# EAGLE design ardcore (EAGLE 6.4)
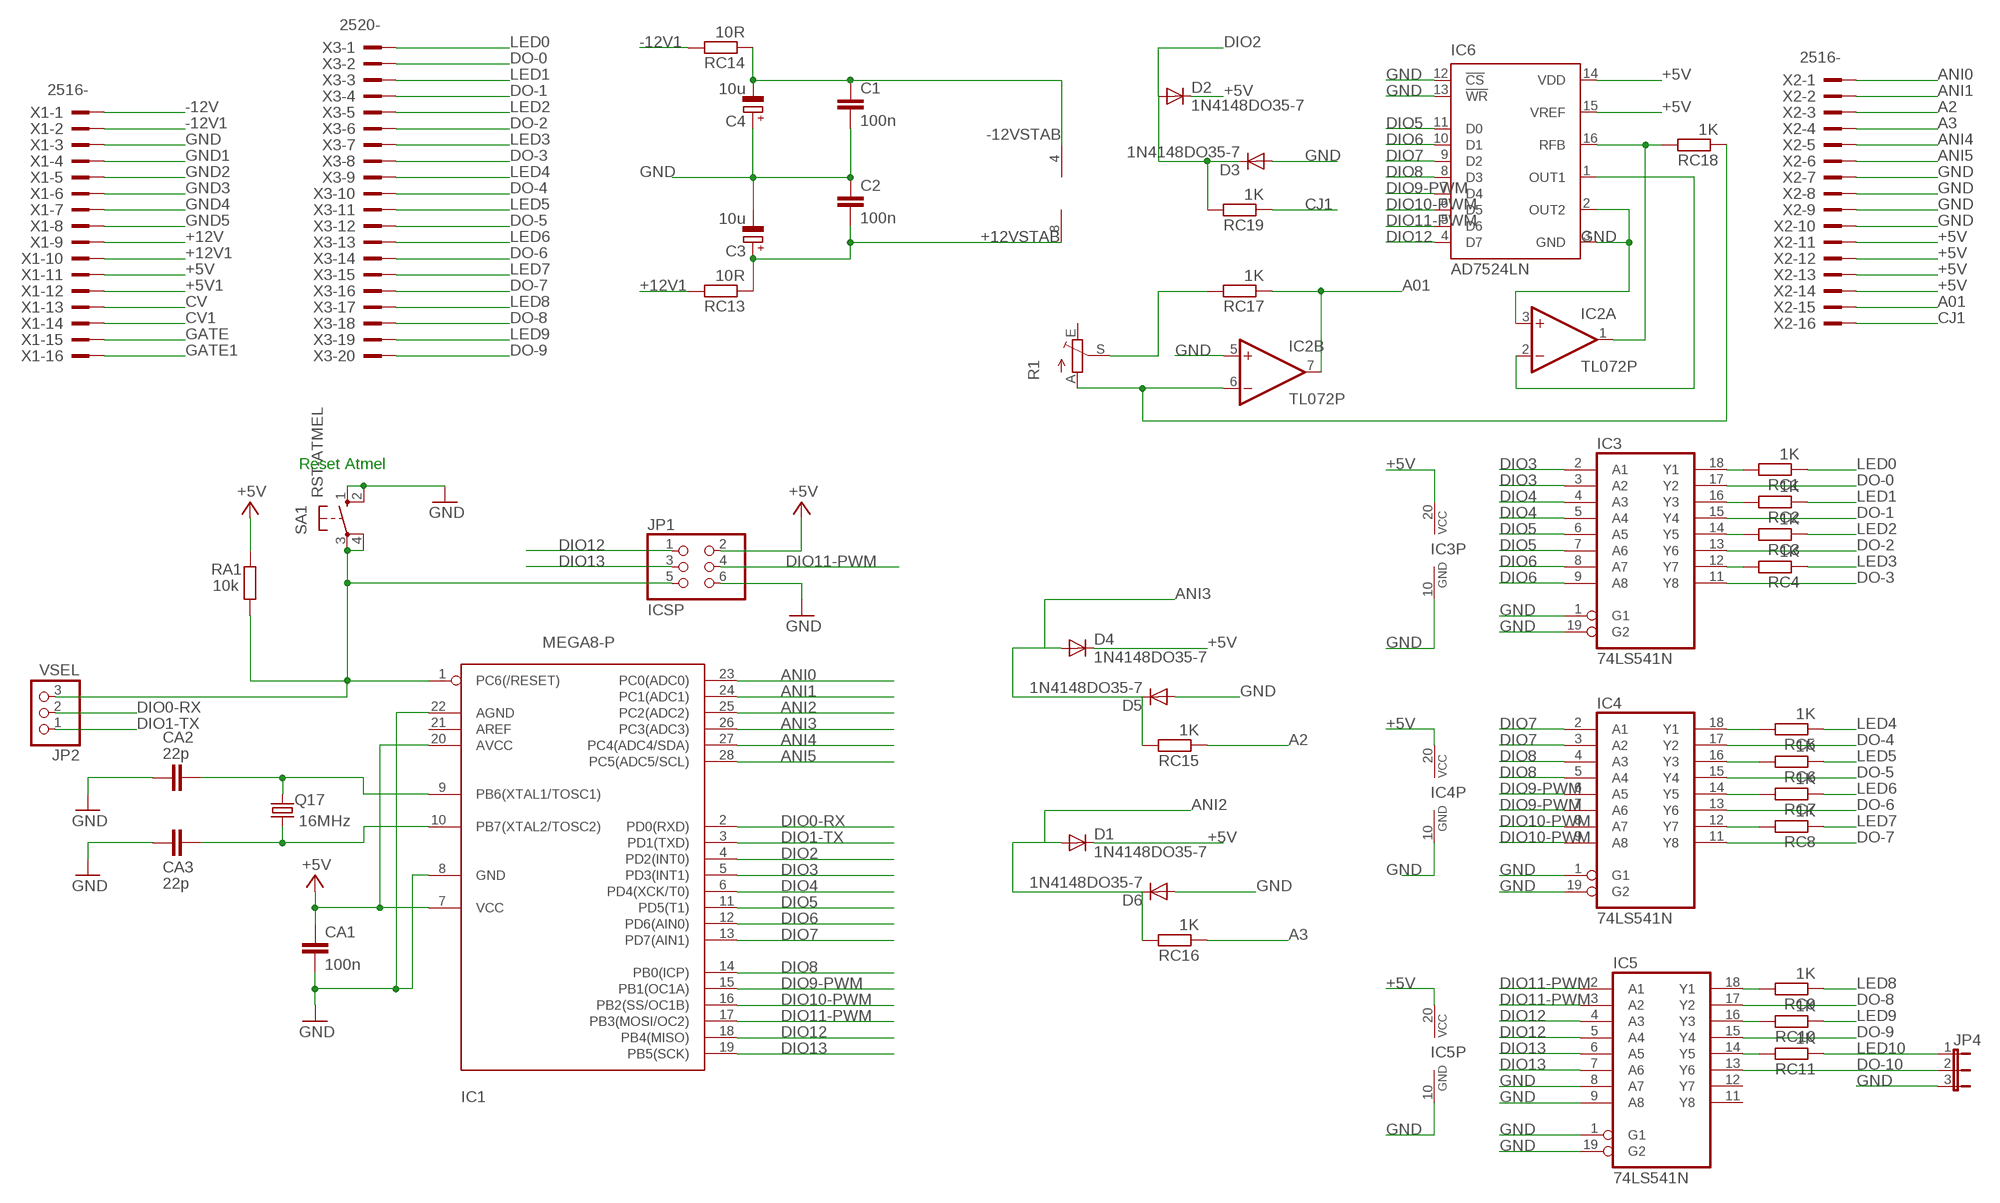
[diagram p0: schematic, sheet 1]

## Parts
C1  100n  C-EU050-025X075  [C050-025X075]
C2  100n  C-EU050-025X075  [C050-025X075]
C3  10u  CPOL-EUE2.5-7  [E2,5-7]
C4  10u  CPOL-EUE2.5-7  [E2,5-7]
CA1  100n  C-EU050-025X075  [C050-025X075]
CA2  22p  C-EU050-025X075  [C050-025X075]
CA3  22p  C-EU050-025X075  [C050-025X075]
D1  1N4148DO35-7  [DO35-7]
D2  1N4148DO35-7  [DO35-7]
D3  1N4148DO35-7  [DO35-7]
D4  1N4148DO35-7  [DO35-7]
D5  1N4148DO35-7  [DO35-7]
D6  1N4148DO35-7  [DO35-7]
IC1  MEGA8-P  [DIL28-3]
IC2  TL072P  [DIL08]
IC3  74LS541N  [DIL20]
IC4  74LS541N  [DIL20]
IC5  74LS541N  [DIL20]
IC6  AD7524LN  [DIL16]
JP1  ICSP  PINHD-2X3  [2X03]
JP2  VSEL  PINHD-1X3  [1X03]
JP4  JP2E  [JP2]
Q17  16MHz  CRYSTALHC49S  [HC49/S]
R1  TRIM_EU-B64Y  [B64Y]
RA1  10k  R-EU_0207/10  [0207/10]
RC1  1K  R-EU_0207/10  [0207/10]
RC2  1K  R-EU_0207/10  [0207/10]
RC3  1K  R-EU_0207/10  [0207/10]
RC4  1K  R-EU_0207/10  [0207/10]
RC5  1K  R-EU_0207/10  [0207/10]
RC6  1K  R-EU_0207/10  [0207/10]
RC7  1K  R-EU_0207/10  [0207/10]
RC8  1K  R-EU_0207/10  [0207/10]
RC9  1K  R-EU_0207/10  [0207/10]
RC10  1K  R-EU_0207/10  [0207/10]
RC11  1K  R-EU_0207/10  [0207/10]
RC13  10R  R-EU_0207/10  [0207/10]
RC14  10R  R-EU_0207/10  [0207/10]
RC15  1K  R-EU_0207/10  [0207/10]
RC16  1K  R-EU_0207/10  [0207/10]
RC17  1K  R-EU_0207/10  [0207/10]
RC18  1K  R-EU_0207/10  [0207/10]
RC19  1K  R-EU_0207/10  [0207/10]
SA1  RST-ATMEL  10-XX  [B3F-10XX]
X1  2516-  [PAK100/2500-16]
X2  2516-  [PAK100/2500-16]
X3  2520-  [PAK100/2500-20]

## Nets
+5V [Power]: CA1.1 D1.C D2.C D4.C IC1.7(VCC) IC1.20(AVCC) IC3.20(VCC) IC4.20(VCC) IC5.20(VCC) IC6.14(VDD) IC6.15(VREF) JP1.2 RA1.1 X1.11 X2.11 X2.12 X2.13 X2.14
+5V1: X1.12
+12V: X1.9
+12V1: RC13.2 X1.10
+12VSTAB: C2.2 C3.+ IC2.8(P:V+) RC13.1
-12V: X1.1
-12V1: RC14.2 X1.2
-12VSTAB: C1.1 C4.- IC2.4(P:V-) RC14.1
A01: IC2.7(B:OUT) RC17.1 X2.15
A2: RC15.1 X2.3
A3: RC16.1 X2.4
ANI0: IC1.23(PC0(ADC0)) X2.1
ANI1: IC1.24(PC1(ADC1)) X2.2
ANI2: D1.A D6.C IC1.25(PC2(ADC2)) RC16.2
ANI3: D4.A D5.C IC1.26(PC3(ADC3)) RC15.2
ANI4: IC1.27(PC4(ADC4/SDA)) X2.5
ANI5: IC1.28(PC5(ADC5/SCL)) X2.6
CJ1: RC19.1 X2.16
CV: X1.13
CV1: X1.14
DIO0-RX: IC1.2(PD0(RXD)) JP2.2
DIO1-TX: IC1.3(PD1(TXD)) JP2.1
DIO2: D2.A D3.C IC1.4(PD2(INT0)) RC19.2
DIO3: IC1.5(PD3(INT1)) IC3.2(A1) IC3.3(A2)
DIO4: IC1.6(PD4(XCK/T0)) IC3.4(A3) IC3.5(A4)
DIO5: IC1.11(PD5(T1)) IC3.6(A5) IC3.7(A6) IC6.11(D0)
DIO6: IC1.12(PD6(AIN0)) IC3.8(A7) IC3.9(A8) IC6.10(D1)
DIO7: IC1.13(PD7(AIN1)) IC4.2(A1) IC4.3(A2) IC6.9(D2)
DIO8: IC1.14(PB0(ICP)) IC4.4(A3) IC4.5(A4) IC6.8(D3)
DIO9-PWM: IC1.15(PB1(OC1A)) IC4.6(A5) IC4.7(A6) IC6.7(D4)
DIO10-PWM: IC1.16(PB2(SS/OC1B)) IC4.8(A7) IC4.9(A8) IC6.6(D5)
DIO11-PWM: IC1.17(PB3(MOSI/OC2)) IC5.2(A1) IC5.3(A2) IC6.5(D6) JP1.4
DIO12: IC1.18(PB4(MISO)) IC5.4(A3) IC5.5(A4) IC6.4(D7) JP1.1
DIO13: IC1.19(PB5(SCK)) IC5.6(A5) IC5.7(A6) JP1.3
DO-0: IC3.17(Y2) X3.2
DO-1: IC3.15(Y4) X3.4
DO-2: IC3.13(Y6) X3.6
DO-3: IC3.11(Y8) X3.8
DO-4: IC4.17(Y2) X3.10
DO-5: IC4.15(Y4) X3.12
DO-6: IC4.13(Y6) X3.14
DO-7: IC4.11(Y8) X3.16
DO-8: IC5.17(Y2) X3.18
DO-9: IC5.15(Y4) X3.20
DO-10: IC5.13(Y6) JP4.2
GATE: X1.15
GATE1: X1.16
GND [GND]: C1.2 C2.1 C3.- C4.+ CA1.2 CA2.2 CA3.2 D3.A D5.A D6.A IC1.8(GND) IC1.22(AGND) IC2.3(A:+IN) IC2.5(B:+IN) IC3.1(G1) IC3.10(GND) IC3.19(G2) IC4.1(G1) IC4.10(GND) IC4.19(G2) IC5.1(G1) IC5.8(A7) IC5.9(A8) IC5.10(GND) IC5.19(G2) IC6.2(OUT2) IC6.3(GND) IC6.12(!CS) IC6.13(!WR) JP1.6 JP4.3 SA1.1(S) SA1.2(S1) X1.3 X2.7 X2.8 X2.9 X2.10
GND1: X1.4
GND2: X1.5
GND3: X1.6
GND4: X1.7
GND5: X1.8
LED0: RC1.1 X3.1
LED1: RC2.1 X3.3
LED2: RC3.1 X3.5
LED3: RC4.1 X3.7
LED4: RC5.1 X3.9
LED5: RC6.1 X3.11
LED6: RC7.1 X3.13
LED7: RC8.1 X3.15
LED8: RC9.1 X3.17
LED9: RC10.1 X3.19
LED10: JP4.1 RC11.1
N$1: IC3.18(Y1) RC1.2
N$3: IC3.16(Y3) RC2.2
N$4: IC3.14(Y5) RC3.2
N$5: CA2.1 IC1.9(PB6(XTAL1/TOSC1)) Q17.2
N$6: CA3.1 IC1.10(PB7(XTAL2/TOSC2)) Q17.1
N$7: IC3.12(Y7) RC4.2
N$8: IC4.18(Y1) RC5.2
N$9: IC4.16(Y3) RC6.2
N$10: IC4.14(Y5) RC7.2
N$11: IC4.12(Y7) RC8.2
N$12: IC5.18(Y1) RC9.2
N$13: IC5.16(Y3) RC10.2
N$14: IC5.14(Y5) RC11.2
N$17: IC2.6(B:-IN) R1.A RC18.1
N$18: IC2.2(A:-IN) IC6.1(OUT1)
N$19: R1.S RC17.2
N$20: IC2.1(A:OUT) IC6.16(RFB) RC18.2
RST: IC1.1(PC6(/RESET)) JP1.5 JP2.3 RA1.2 SA1.3(P) SA1.4(P1)
Unconnected: IC1.21(AREF) IC5.11(Y8) IC5.12(Y7) R1.E

## Notes on the sheet
- Reset Atmel

## Library data of the parts
C1 C2 CA1-CA3 = rcl:C-EU: CAPACITOR, European symbol
C3 C4 = rcl:CPOL-EU: POLARIZED CAPACITOR, European symbol
D1-D6 = diode:1N4148: DIODE high speed (Philips)
IC1 = atmel:MEGA8-P: MICROCONTROLLER 8 Kbytes FLASH, 1 kbytes SRAM, 512 bytes EEPROM, USART, 4-channel 10 bit ADC, 2-channel 8 bit ADC Pin compatible with Atmega48, ATMega88, ATMega168 Source: avr.lbr
IC2 = linear:TL072: OP AMP
IC3-IC5 = 74xx-eu:74*541: Octal BUFFER and LINE DRIVER, 3-state
IC6 = analog-devices:AD7524*: 8-Bit Buffered Multiplying DAC Source: http://www.analog.com/UploadedFiles/Data_Sheets/888358036ad7524.pdf; MF: ALTERA CORPORATION; MPN: AD7524LNZ; OC_FARNELL: 9605401; OC_NEWARK: 59K4974
JP1 = pinhead:PINHD-2X3: PIN HEADER
JP2 = pinhead:PINHD-1X3: PIN HEADER
JP4 = jumper:JP2E: JUMPER
Q17 = crystal:CRYSTAL: CRYSTAL
R1 = pot:TRIM_EU-: POTENTIOMETER
RA1 RC1-RC11 RC13-RC19 = rcl:R-EU_: RESISTOR, European symbol
SA1 = switch-omron:10-XX: OMRON SWITCH
X1 X2 = con-3m:2516-: 3M (TM) Pak 100 4-Wall Header Source: 3M; OC_FARNELL: unknown; OC_NEWARK: unknown
X3 = con-3m:2520-: 3M (TM) Pak 100 4-Wall Header Source: 3M; OC_FARNELL: unknown; OC_NEWARK: unknown

## Net classes
0 default: width 0.406 mm, drill 0.254 mm, clearance 0.254 mm
1 Leds: width 0.61 mm, drill 0.508 mm, clearance 0.305 mm
2 Power: width 0.61 mm, drill 0.508 mm, clearance 0.305 mm
3 GND: width 0.61 mm, drill 0.508 mm, clearance 0.305 mm

## Board
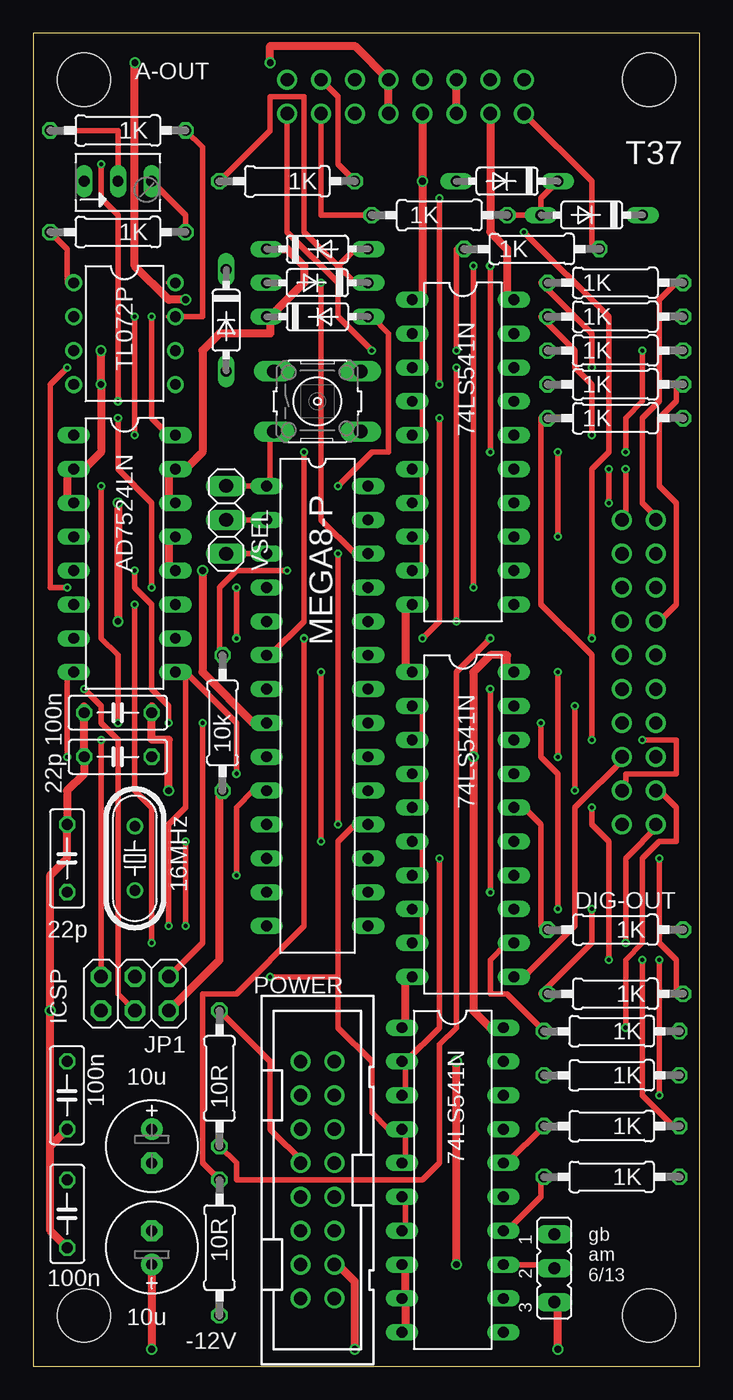
[diagram p1: board, top side]
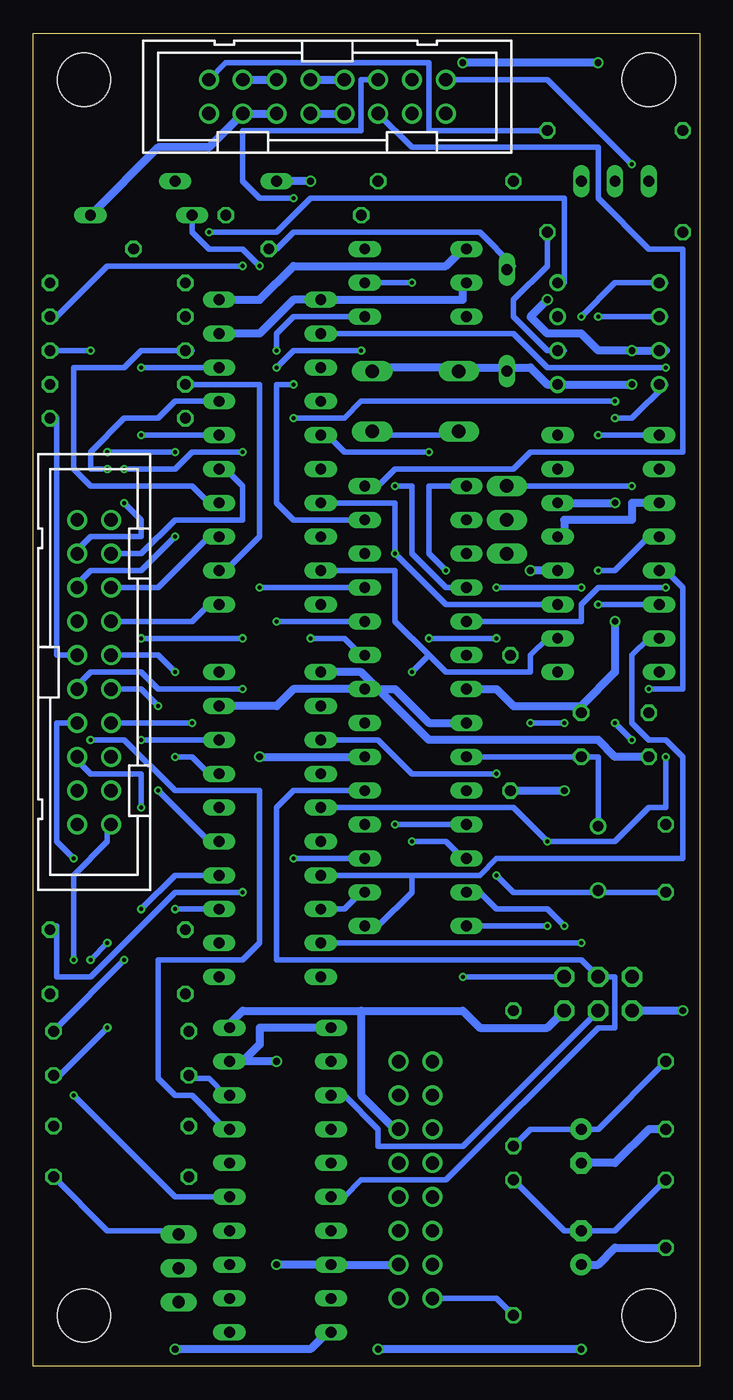
[diagram p2: board, bottom side, seen from below]

Size 50.01 x 100 mm. Coordinates in mm from the lower left corner, seen from the top.
Outline: 0,0 50.01,0 50.01,100 0,100 0,0
Copper layers (1*2*15*16): Top 0.035mm / dielectric 0.2mm / Route2 0.0175mm / dielectric 1.1mm / Route15 0.0175mm / dielectric 0.2mm / Bottom 0.035mm
Design rules "SeeedStudio_DRU_no_angle_20130527": minimum track width 6mil, minimum drill 12mil, track to track 6mil, track to pad 6mil, pad to pad 6mil, via to via 6mil, smd to smd 0mil, copper to edge 10mil, drill to drill 10mil, minimum pad ring 6mil, minimum via ring 6mil, stop-mask expansion 2mil, vias tented up to drill 25mil, thermal gap 10mil
Holes 4 mm at 3.81,96.52 46.22,96.52 3.81,3.81 46.22,3.81

### Footprints (pad centres in the part's own frame; a part is rotated, then mirrored left to right if it is on the bottom)
C050-025X075 = drill 0.813 octagon: 1 -2.54,0; 2 2.54,0
E2,5-7 = drill 0.813 pad 1.6: + -1.27,0 | drill 0.813 pad 1.6 octagon: - 1.27,0
DO35-7 = drill 0.813 long: A 3.81,0; C -3.81,0
DIL28-3 = drill 0.813 long: 1 -16.51,-3.81; 2 -13.97,-3.81; 3 -11.43,-3.81; 4 -8.89,-3.81; 5 -6.35,-3.81; 6 -3.81,-3.81; 7 -1.27,-3.81; 8 1.27,-3.81; 9 3.81,-3.81; 10 6.35,-3.81; 11 8.89,-3.81; 12 11.43,-3.81; 13 13.97,-3.81; 14 16.51,-3.81; 15 16.51,3.81; 16 13.97,3.81; 17 11.43,3.81; 18 8.89,3.81; 19 6.35,3.81; 20 3.81,3.81; 21 1.27,3.81; 22 -1.27,3.81; 23 -3.81,3.81; 24 -6.35,3.81; 25 -8.89,3.81; 26 -11.43,3.81; 27 -13.97,3.81; 28 -16.51,3.81
DIL08 = drill 0.813 pad 1.27: 1 -3.81,-3.81; 2 -1.27,-3.81; 3 1.27,-3.81; 4 3.81,-3.81; 5 3.81,3.81; 6 1.27,3.81; 7 -1.27,3.81; 8 -3.81,3.81
DIL20 = drill 0.813 long: 1 -11.43,-3.81; 2 -8.89,-3.81; 3 -6.35,-3.81; 4 -3.81,-3.81; 5 -1.27,-3.81; 6 1.27,-3.81; 7 3.81,-3.81; 8 6.35,-3.81; 9 8.89,-3.81; 10 11.43,-3.81; 11 11.43,3.81; 12 8.89,3.81; 13 6.35,3.81; 14 3.81,3.81; 15 1.27,3.81; 16 -1.27,3.81; 17 -3.81,3.81; 18 -6.35,3.81; 19 -8.89,3.81; 20 -11.43,3.81
DIL16 = drill 0.813 long: 1 -8.89,-3.81; 2 -6.35,-3.81; 3 -3.81,-3.81; 4 -1.27,-3.81; 5 1.27,-3.81; 6 3.81,-3.81; 7 6.35,-3.81; 8 8.89,-3.81; 9 8.89,3.81; 10 6.35,3.81; 11 3.81,3.81; 12 1.27,3.81; 13 -1.27,3.81; 14 -3.81,3.81; 15 -6.35,3.81; 16 -8.89,3.81
2X03 = drill 1.016 octagon: 1 -2.54,-1.27; 2 -2.54,1.27; 3 0,-1.27; 4 0,1.27; 5 2.54,-1.27; 6 2.54,1.27
1X03 = drill 1.016 long: 1 -2.54,0; 2 0,0; 3 2.54,0
JP2 = drill 0.914 long: 1 -2.54,0; 2 0,0; 3 2.54,0
HC49/S = drill 0.813: 1 -2.413,0; 2 2.413,0
B64Y = drill 0.813 long: A 2.54,0; E -2.54,0; S 0,0
0207/10 = drill 0.813 octagon: 1 -5.08,0; 2 5.08,0
B3F-10XX = drill 1.016 long: 1 -3.251,2.261; 2 3.251,2.261; 3 -3.251,-2.261; 4 3.251,-2.261
PAK100/2500-16 = drill 1 pad 1.422: 1 -8.89,-1.27; 2 -8.89,1.27; 3 -6.35,-1.27; 4 -6.35,1.27; 5 -3.81,-1.27; 6 -3.81,1.27; 7 -1.27,-1.27; 8 -1.27,1.27; 9 1.27,-1.27; 10 1.27,1.27; 11 3.81,-1.27; 12 3.81,1.27; 13 6.35,-1.27; 14 6.35,1.27; 15 8.89,-1.27; 16 8.89,1.27
PAK100/2500-20 = drill 1 pad 1.422: 1 -11.43,-1.27; 2 -11.43,1.27; 3 -8.89,-1.27; 4 -8.89,1.27; 5 -6.35,-1.27; 6 -6.35,1.27; 7 -3.81,-1.27; 8 -3.81,1.27; 9 -1.27,-1.27; 10 -1.27,1.27; 11 1.27,-1.27; 12 1.27,1.27; 13 3.81,-1.27; 14 3.81,1.27; 15 6.35,-1.27; 16 6.35,1.27; 17 8.89,-1.27; 18 8.89,1.27; 19 11.43,-1.27; 20 11.43,1.27

### Placement (x,y rotation side)
C1  2.54,11.43 270 top
C2  2.54,20.32 90 top
C3  8.89,16.51 270 top
C4  8.89,8.89 90 top
CA1  6.35,49.03 180 top
CA2  6.35,45.72 180 top
CA3  2.54,38.1 90 top
D1  41.91,86.36 180 top
D2  21.32,78.74 0 top
D3  14.47,78.47 270 top
D4  21.32,83.82 0 top
D5  21.32,81.28 180 top
D6  35.56,88.9 180 top
IC1  21.32,49.53 270 top
IC2  6.85,77.47 270 top
IC3  32.25,68.58 270 top
IC4  32.25,40.64 270 top
IC5  31.48,13.97 270 top
IC6  6.85,60.96 270 top
JP1  7.62,27.94 180 top
JP2  14.47,63.5 90 top
JP4  39.1,7.35 270 top
Q17  7.62,38.1 90 top
R1  6.35,88.9 0 top
RA1  14.2,48.26 90 top
RC1  43.68,81.28 180 top
RC2  43.68,78.74 180 top
RC3  43.68,76.2 180 top
RC4  43.68,73.66 180 top
RC5  43.68,71.12 180 top
RC6  43.68,32.75 180 top
RC7  43.68,27.94 180 top
RC8  43.41,25.13 180 top
RC9  43.41,21.82 180 top
RC10  43.41,18.01 180 top
RC11  43.41,14.2 180 top
RC13  13.97,21.59 90 top
RC14  13.97,8.89 270 top
RC15  19.05,88.9 180 top
RC16  30.48,86.36 0 top
RC17  6.35,92.71 180 top
RC18  6.35,85.09 180 top
RC19  37.41,83.82 180 top
SA1  21.32,72.39 0 top
X1  21.32,13.97 90 top
X2  27.94,95.25 180 bottom
X3  45.45,52.07 270 bottom

### Tracks (layer width: path | path; a pad name or v marks a point on that pad's centre or on a via)
+5V  (via drill 0.51)
  Top 0.61: JP1.2 13.97,30.48 13.97,43.18 RA1.1 | v10.16,43.18 10.16,46.99 8.89,46.99 CA1.1 8.89,49.53 | IC5.20 34.29,25.4 33.02,26.67 v33.02,45.72 33.02,52.07 34.29,53.34 35.56,53.34 35.56,52.07 IC4.20 | IC6.14 10.16,64.77 10.16,67.31 IC6.15 11.43,67.31 12.7,68.58 12.7,76.2 13.97,77.47 17.78,77.47 17.78,78.74 | 17.78,78.74 20.32,81.28 20.32,82.55 19.05,83.82 D4.C | 17.78,78.74 D2.C | X2.14 34.29,85.09 35.56,83.82 35.56,80.01 IC3.20 | X2.12 X2.11 | v6.35,64.77 v6.35,55.88
  Bottom 0.61: 8.89,49.53 13.97,49.53 15.24,50.8 IC1.7 | RA1.1 v10.16,43.18 | v33.02,45.72 IC1.20 | 25.4,26.67 25.4,20.32 22.86,17.78 X1.11 | 25.4,26.67 34.29,26.67 35.56,25.4 IC5.20 | JP1.2 11.43,25.4 16.51,25.4 17.78,26.67 25.4,26.67 | X2.13 X2.11 | D1.C 40.64,91.44 36.83,91.44 X2.14 X2.12 | IC3.20 33.02,80.01 30.48,82.55 19.05,82.55 17.78,83.82 D4.C | 8.89,49.53 6.35,52.07 v6.35,55.88 | IC6.14 v6.35,64.77 | 8.89,49.53 CA1.1
+12V1
  Top 0.406: RC13.2 17.78,22.86 17.78,17.78 20.32,15.24 X1.10
+12VSTAB  (via drill 0.3)
  Top 0.406: 10.16,81.28 IC2.8 | v36.83,85.09 43.18,78.74 43.18,68.58 41.91,67.31 v41.91,54.61 | v34.29,54.61 31.75,52.07 31.75,25.4 30.48,24.13 30.48,15.24 29.21,13.97 15.24,13.97 15.24,15.24 RC13.1
  Bottom 0.406: C2.2 7.62,17.78 C3.+ 12.7,17.78 RC13.1 | v36.83,85.09 31.75,85.09 29.21,87.63 10.16,87.63 10.16,81.28 IC2.8 | v34.29,54.61 v41.91,54.61
-12V1
  Bottom 0.406: RC14.2 15.24,5.08 X1.2 20.32,5.08
-12VSTAB  (via drill 0.3)
  Top 0.406: v6.35,71.12 6.35,67.31 8.89,64.77 v8.89,58.42 | v15.24,54.61 v15.24,58.42 | v20.32,54.61 20.32,33.02 15.24,27.94 12.7,27.94 12.7,15.24 RC14.1
  Bottom 0.406: C1.1 6.35,10.16 C4.- 10.16,10.16 RC14.1 | v6.35,71.12 5.08,71.12 2.54,73.66 IC2.4 | v15.24,58.42 v8.89,58.42 | v20.32,54.61 v15.24,54.61
A01
  Top 0.406: RC17.1 12.7,91.44 12.7,78.74 IC2.7 10.16,78.74
  Bottom 0.406: X2.15 35.56,97.79 20.32,97.79 20.32,92.71 RC17.1
A2
  Top 0.406: RC15.1 22.86,90.17 22.86,95.25 X2.3
A3
  Top 0.406: RC16.1 21.59,86.36 X2.4
ANI0  (via drill 0.3)
  Top 0.406: v29.21,54.61 30.48,55.88 v30.48,71.12 | v6.35,72.39 6.35,86.36 5.08,87.63 v5.08,90.17
  Bottom 0.406: v29.21,54.61 26.67,54.61 25.4,53.34 IC1.23 | v30.48,71.12 26.67,71.12 25.4,72.39 v6.35,72.39 | v5.08,90.17 11.43,96.52 X2.1
ANI1  (via drill 0.3)
  Top 0.406: v31.75,74.93 v31.75,55.88 | v25.4,76.2 22.86,78.74 22.86,81.28 19.05,85.09 X2.2
  Bottom 0.406: v31.75,55.88 IC1.24 | v31.75,74.93 30.48,76.2 v25.4,76.2
ANI2  (via drill 0.3)
  Top 0.406: v33.02,82.55 v33.02,58.42 | RC16.2 D1.A 38.1,87.63 D6.C
  Bottom 0.406: v33.02,58.42 IC1.25 | v33.02,82.55 34.29,83.82 36.83,83.82 38.1,85.09 D1.A
ANI3  (via drill 0.3)
  Top 0.406: RC15.2 17.78,92.71 17.78,95.25 20.32,95.25 20.32,85.09 22.86,82.55 | 22.86,82.55 24.13,81.28 D5.C | v21.59,81.28 21.59,63.5 24.13,60.96 IC1.26 | 22.86,82.55 24.13,83.82 D4.A
  Bottom 0.406: D5.C v21.59,81.28
ANI4  (via drill 0.3)
  Top 0.406: v30.48,87.63 v30.48,73.66
  Bottom 0.406: IC1.27 30.48,63.5 31.75,64.77 31.75,73.66 v30.48,73.66 | v30.48,87.63 33.02,87.63 34.29,88.9 34.29,92.71 25.4,92.71 25.4,96.52 X2.5
ANI5
  Bottom 0.406: X2.6 21.59,91.44 7.62,91.44 7.62,87.63 3.81,83.82 1.27,83.82 1.27,68.58 12.7,68.58 13.97,67.31 22.86,67.31 24.13,66.04 IC1.28
CJ1
  Top 0.406: X2.16 41.91,88.9 41.91,83.82 RC19.1
DIO0-RX
  Top 0.406: JP2.2 IC1.2
DIO1-TX
  Top 0.406: JP2.1 IC1.3
DIO2  (via drill 0.3)
  Top 0.406: v22.86,66.04 25.4,68.58 26.67,68.58 26.67,77.47 25.4,78.74 D2.A | v31.75,76.2 31.75,83.82 RC19.2
  Bottom 0.406: D3.C 13.97,82.55 16.51,85.09 30.48,85.09 31.75,83.82 RC19.2 | IC1.4 19.05,58.42 21.59,60.96 21.59,66.04 v22.86,66.04 | v31.75,76.2 31.75,77.47 30.48,78.74 D2.A
DIO3  (via drill 0.3)
  Top 0.406: v2.54,58.42 1.27,58.42 1.27,73.66 v2.54,74.93 | IC3.3 29.21,74.93 29.21,77.47 IC3.2
  Bottom 0.406: IC1.5 8.89,55.88 8.89,57.15 7.62,58.42 v2.54,58.42 | v2.54,74.93 11.43,74.93 13.97,77.47 IC3.2
DIO4  (via drill 0.3)
  Top 0.406: v20.32,68.58 20.32,55.88 17.78,53.34 IC1.6 | IC3.4 29.21,72.39 29.21,69.85 IC3.5
  Bottom 0.406: v20.32,68.58 26.67,68.58 27.94,69.85 IC3.5
DIO5  (via drill 0.3)
  Top 0.406: v22.86,60.96 v22.86,40.64 | IC3.6 29.21,67.31 29.21,64.77 IC3.7
  Bottom 0.406: IC6.11 19.05,57.15 v22.86,60.96 22.86,64.77 IC3.7 | v22.86,40.64 IC1.11
DIO6  (via drill 0.3)
  Top 0.406: v21.59,52.07 v21.59,39.37 | IC3.8 29.21,62.23 29.21,59.69 IC3.9
  Bottom 0.406: 20.32,53.34 22.86,55.88 22.86,59.69 IC3.9 | 20.32,53.34 19.05,52.07 12.7,52.07 12.7,53.34 11.43,54.61 IC6.10 | v21.59,39.37 19.05,39.37 17.78,38.1 IC1.12 | 20.32,53.34 v21.59,52.07
DIO7  (via drill 0.3)
  Top 0.406: 11.43,52.07 15.24,48.26 v15.24,44.45 | v10.16,33.02 10.16,40.64 11.43,41.91 11.43,52.07 | 11.43,52.07 IC6.9 | IC4.2 29.21,49.53 29.21,46.99 IC4.3
  Bottom 0.406: v15.24,44.45 21.59,44.45 24.13,46.99 IC4.3 | v10.16,33.02 11.43,34.29 15.24,34.29 16.51,35.56 IC1.13
DIO8  (via drill 0.3)
  Top 0.406: v11.43,39.37 v11.43,33.02 | v2.54,45.72 2.54,52.07 IC6.8 | IC4.4 29.21,44.45 29.21,41.91 IC4.5
  Bottom 0.406: v11.43,33.02 IC1.14 | IC4.5 13.97,41.91 v11.43,39.37 6.35,39.37 3.81,41.91 2.54,41.91 v2.54,45.72
DIO9-PWM
  Top 0.406: IC4.6 29.21,39.37 29.21,36.83 IC4.7
  Bottom 0.406: 21.59,36.83 21.59,35.56 24.13,33.02 IC1.15 | IC4.7 21.59,36.83 | 21.59,36.83 16.51,36.83 15.24,38.1 1.27,38.1 1.27,45.72 2.54,46.99 3.81,46.99 5.08,48.26 5.08,53.34 3.81,54.61 IC6.7
DIO10-PWM  (via drill 0.3)
  Top 0.406: v7.62,57.15 7.62,43.18 8.89,41.91 v8.89,31.75 | IC4.8 29.21,34.29 29.21,31.75 IC4.9
  Bottom 0.406: v7.62,57.15 IC6.6 | IC4.9 v8.89,31.75 | IC4.8 26.67,34.29 25.4,35.56 IC1.16
DIO11-PWM  (via drill 0.3)
  Top 0.406: 27.94,22.86 27.94,20.32 IC5.3 | v30.48,38.1 30.48,25.4 27.94,22.86 | 27.94,22.86 IC5.2 | v3.81,50.8 5.08,49.53 5.08,48.26 6.35,46.99 6.35,27.94 JP1.4
  Bottom 0.406: v30.48,38.1 IC1.17 | v3.81,50.8 1.27,50.8 1.27,58.42 2.54,59.69 IC6.5 | JP1.4 17.78,16.51 24.13,16.51 24.13,17.78 26.67,20.32 IC5.3
DIO12  (via drill 0.3)
  Top 0.406: IC5.5 27.94,15.24 27.94,17.78 IC5.4 26.67,17.78 25.4,19.05 25.4,22.86 22.86,25.4 22.86,29.21 | 22.86,29.21 22.86,39.37 24.13,40.64 IC1.18 | v7.62,59.69 7.62,58.42 8.89,57.15 8.89,50.8 10.16,49.53 v10.16,48.26 | v12.7,48.26 12.7,31.75 JP1.1 | v17.78,29.21 22.86,29.21
  Bottom 0.406: v7.62,59.69 6.35,59.69 3.81,62.23 IC6.4 | v12.7,48.26 v10.16,48.26 | JP1.1 v17.78,29.21
DIO13
  Top 0.406: IC5.7 27.94,10.16 27.94,12.7 IC5.6
  Bottom 0.406: IC1.19 30.48,43.18 31.75,41.91 31.75,30.48 8.89,30.48 JP1.3 6.35,29.21 6.35,25.4 7.62,25.4 19.05,13.97 25.4,13.97 26.67,12.7 IC5.6
DO-0  (via drill 0.3)
  Top 0.406: v44.45,67.31 44.45,63.5 X3.2
  Bottom 0.406: IC3.17 39.37,72.39 40.64,71.12 43.18,71.12 45.72,68.58 45.72,67.31 v44.45,67.31
DO-1
  Bottom 0.406: IC3.15 35.56,67.31 34.29,66.04 34.29,63.5 39.37,63.5 41.91,60.96 X3.4 44.45,60.96
DO-2
  Bottom 0.406: IC3.13 36.83,62.23 40.64,58.42 X3.6 44.45,58.42
DO-3
  Bottom 0.406: IC3.11 36.83,57.15 38.1,55.88 X3.8 44.45,55.88
DO-4  (via drill 0.3)
  Top 0.406: v39.37,52.07 v39.37,45.72
  Bottom 0.406: v39.37,45.72 38.1,45.72 36.83,44.45 IC4.17 | v39.37,52.07 40.64,53.34 X3.10 44.45,53.34
DO-5  (via drill 0.3)
  Top 0.406: v40.64,49.53 v40.64,43.18
  Bottom 0.406: v40.64,43.18 36.83,39.37 IC4.15 | v40.64,49.53 41.91,50.8 X3.12 44.45,50.8
DO-6  (via drill 0.3)
  Top 0.406: v39.37,34.29 39.37,44.45 38.1,45.72 v38.1,48.26
  Bottom 0.406: v39.37,34.29 IC4.13 | v38.1,48.26 X3.14 44.45,48.26
DO-7
  Top 0.406: IC4.11 36.83,29.21 40.64,33.02 40.64,41.91 44.45,45.72 X3.16
DO-8  (via drill 0.3)
  Top 0.406: v45.72,46.99 48.26,46.99 48.26,44.45 44.45,44.45 44.45,43.18 X3.18
  Bottom 0.406: v45.72,46.99 43.18,46.99 39.37,43.18 33.02,43.18 33.02,31.75 34.29,30.48 40.64,30.48 40.64,21.59 39.37,20.32 38.1,20.32 35.56,17.78 IC5.17
DO-9  (via drill 0.3)
  Top 0.406: v46.99,30.48 v46.99,20.32
  Bottom 0.406: IC5.15 39.37,12.7 v46.99,20.32 | v46.99,30.48 46.99,36.83 44.45,39.37 44.45,40.64 X3.20
DO-10
  Top 0.406: IC5.13 38.1,7.62 JP4.2
GND  (via drill 0.51)
  Top 0.61: X2.10 v29.21,88.9 29.21,80.01 IC3.1 | X2.8 X2.7 24.13,99.06 17.78,99.06 v17.78,97.79 | IC4.1 27.94,52.07 27.94,57.15 IC3.10 | IC6.12 10.16,59.69 10.16,62.23 IC6.13 | IC6.3 2.54,64.77 2.54,67.31 IC6.2 3.81,67.31 5.08,68.58 v5.08,73.66 v5.08,76.2 | v12.7,59.69 12.7,52.07 16.51,48.26 IC1.8 | v7.62,97.79 7.62,82.55 10.16,80.01 v11.43,80.01 | IC4.10 27.94,29.21 27.94,25.4 IC5.1 | 27.94,5.08 27.94,2.54 IC5.10 | 27.94,5.08 27.94,7.62 IC5.8 | 27.94,5.08 IC5.9 | v39.37,1.27 39.37,5.08 JP4.3 | v31.75,7.62 v31.75,22.86 | 3.81,49.53 CA1.2 CA2.2 3.81,44.45 2.54,43.18 CA3.2 2.54,38.1 1.27,36.83 v1.27,26.67 1.27,16.51 | 1.27,16.51 C2.1 | 1.27,16.51 1.27,10.16 C1.2 | v24.13,1.27 24.13,6.35 22.86,7.62 X1.3 | C4.+ v8.89,1.27
  Bottom 0.61: X2.9 X2.7 | D5.A 17.78,81.28 17.78,80.01 IC3.1 30.48,80.01 33.02,77.47 IC3.19 | v29.21,88.9 D6.A | X2.10 X2.8 | IC1.8 20.32,48.26 22.86,50.8 24.13,50.8 | IC4.19 31.75,49.53 30.48,50.8 IC1.22 24.13,50.8 | IC4.1 25.4,52.07 24.13,50.8 | 13.97,74.93 17.78,74.93 SA1.1 19.05,74.93 24.13,74.93 SA1.2 | 13.97,74.93 12.7,74.93 11.43,73.66 IC2.5 10.16,73.66 v5.08,73.66 | 13.97,74.93 D3.A | 2.54,76.2 IC2.3 v5.08,76.2 7.62,76.2 8.89,77.47 11.43,77.47 12.7,78.74 v11.43,80.01 | IC6.3 5.08,64.77 5.08,63.5 10.16,63.5 10.16,62.23 IC6.13 | IC6.12 v12.7,59.69 | v7.62,97.79 v17.78,97.79 | 34.29,22.86 33.02,24.13 33.02,25.4 IC5.1 | v39.37,1.27 29.21,1.27 27.94,2.54 IC5.10 | X1.3 IC5.8 v31.75,7.62 | v31.75,22.86 34.29,22.86 | 34.29,22.86 IC5.19 | C1.2 6.35,8.89 7.62,7.62 C4.+ | v1.27,26.67 JP1.6 | C3.- 6.35,15.24 3.81,17.78 C2.1 | v8.89,1.27 v24.13,1.27 | 24.13,50.8 20.32,46.99 7.62,46.99 6.35,45.72 CA2.2
LED0
  Top 0.406: RC1.1 48.26,81.28 46.99,80.01 46.99,72.39 45.72,71.12 45.72,64.77 46.99,63.5 X3.1
LED1  (via drill 0.3)
  Top 0.406: v34.29,68.58 v34.29,82.55 | v43.18,64.77 v43.18,67.31
  Bottom 0.406: v34.29,82.55 44.45,82.55 48.26,78.74 RC2.1 | v34.29,68.58 38.1,68.58 39.37,67.31 v43.18,67.31 | v43.18,64.77 41.91,63.5 41.91,62.23 45.72,62.23 46.99,60.96 X3.3
LED2  (via drill 0.3)
  Top 0.406: v45.72,76.2 45.72,72.39 44.45,71.12 v44.45,68.58 | v39.37,62.23 v39.37,68.58
  Bottom 0.406: v45.72,76.2 RC3.1 | v39.37,68.58 v44.45,68.58 | v39.37,62.23 41.91,59.69 45.72,59.69 46.99,58.42 X3.5
LED3
  Top 0.406: RC4.1 48.26,73.66 48.26,72.39 46.99,71.12 46.99,66.04 48.26,64.77 48.26,57.15 46.99,55.88 X3.7
LED4
  Bottom 0.406: X3.9 48.26,53.34 48.26,71.12 RC5.1
LED5  (via drill 0.3)
  Top 0.406: v34.29,50.8 v34.29,35.56
  Bottom 0.406: v34.29,35.56 39.37,35.56 45.72,29.21 48.26,29.21 48.26,33.02 RC6.1 | v34.29,50.8 40.64,50.8 41.91,52.07 45.72,52.07 46.99,50.8 X3.11
LED6  (via drill 0.3)
  Top 0.406: v46.99,38.1 46.99,31.75 48.26,30.48 48.26,27.94 RC7.1
  Bottom 0.406: v46.99,38.1 48.26,39.37 48.26,48.26 X3.13
LED7  (via drill 0.3)
  Top 0.406: v43.18,30.48 43.18,39.37 41.91,40.64 v41.91,41.91
  Bottom 0.406: v43.18,30.48 48.26,25.4 RC8.1 | v41.91,41.91 41.91,44.45 45.72,44.45 46.99,45.72 X3.15
LED8  (via drill 0.3)
  Top 0.406: v44.45,25.4 44.45,30.48 45.72,31.75 45.72,38.1 46.99,39.37 48.26,39.37 48.26,41.91 46.99,43.18 X3.17
  Bottom 0.406: v44.45,25.4 48.26,21.59 RC9.1
LED9  (via drill 0.3)
  Top 0.406: v45.72,30.48 45.72,20.32 48.26,17.78 RC10.1 | v44.45,31.75 44.45,38.1 46.99,40.64 X3.19
  Bottom 0.406: v44.45,31.75 v45.72,30.48
LED10
  Bottom 0.406: RC11.1 44.45,10.16 39.37,10.16 JP4.1
N$1  (via drill 0.3)
  Top 0.406: v41.91,74.93 41.91,77.47 38.1,81.28 RC1.2
  Bottom 0.406: v41.91,74.93 IC3.18
N$3  (via drill 0.3)
  Top 0.406: v41.91,69.85 41.91,73.66 40.64,74.93 40.64,76.2 38.1,78.74 RC2.2
  Bottom 0.406: v41.91,69.85 IC3.16
N$4
  Bottom 0.406: IC3.14 36.83,64.77 38.1,66.04 45.72,66.04 46.99,67.31 46.99,74.93 43.18,74.93 41.91,76.2 RC3.2 38.1,76.2
N$5
  Bottom 0.406: Q17.2 7.62,45.72 CA2.1 IC1.9
N$6  (via drill 0.3)
  Top 0.406: v15.24,36.83 15.24,41.91 16.51,43.18 IC1.10
  Bottom 0.406: 7.62,35.56 CA3.1 | v15.24,36.83 13.97,35.56 7.62,35.56 | 7.62,35.56 Q17.1
N$7
  Bottom 0.406: RC4.2 33.02,73.66 33.02,62.23 35.56,59.69 IC3.12
N$8  (via drill 0.3)
  Top 0.406: v41.91,46.99 41.91,53.34 38.1,57.15 38.1,71.12 RC5.2
  Bottom 0.406: v41.91,46.99 IC4.18
N$9
  Top 0.406: RC6.2 38.1,33.02 38.1,40.64 36.83,41.91 IC4.16
N$10  (via drill 0.3)
  Top 0.406: v41.91,34.29 41.91,31.75 38.1,27.94 RC7.2
  Bottom 0.406: v41.91,34.29 39.37,36.83 IC4.14
N$11
  Top 0.406: RC8.2 38.1,25.4 35.56,27.94 34.29,27.94 34.29,30.48 35.56,31.75 IC4.12
N$12
  Bottom 0.406: IC5.18 35.56,20.32 36.83,21.59 38.1,21.59 RC9.2
N$13
  Top 0.406: RC10.2 35.56,15.24 IC5.16
N$14
  Top 0.406: IC5.14 35.56,10.16 38.1,12.7 38.1,13.97 RC11.2
N$17
  Top 0.406: R1.A 11.43,86.36 RC18.1
  Bottom 0.406: RC18.1 11.43,82.55 13.97,80.01 13.97,78.74 11.43,76.2 IC2.6 10.16,76.2
N$18  (via drill 0.3)
  Top 0.406: v7.62,78.74 v7.62,69.85
  Bottom 0.406: v7.62,69.85 IC6.1 | v7.62,78.74 IC2.2 2.54,78.74
N$19
  Top 0.406: RC17.2 6.35,92.71 R1.S
N$20  (via drill 0.3)
  Top 0.406: RC18.2 2.54,83.82 2.54,81.28 IC2.1 | v8.89,78.74 8.89,71.12 10.16,69.85 IC6.16
  Bottom 0.406: v8.89,78.74 6.35,81.28 IC2.1 2.54,81.28
RST  (via drill 0.3)
  Top 0.406: v19.05,59.69 15.24,59.69 13.97,58.42 13.97,53.34 RA1.2 | SA1.3 17.78,69.85 17.78,66.04 IC1.1 JP2.3 | v5.08,46.99 JP1.5 | v6.35,48.26 6.35,53.34 5.08,54.61 v5.08,66.04
  Bottom 0.406: v19.05,59.69 20.32,60.96 20.32,66.04 IC1.1 | SA1.4 24.13,69.85 19.05,69.85 SA1.3 | v6.35,48.26 v5.08,46.99 | JP2.3 v5.08,66.04

### Text on the board
tNames: A-OUT | T37 | DIG-OUT | POWER | gb / am / 6/13 | -12V